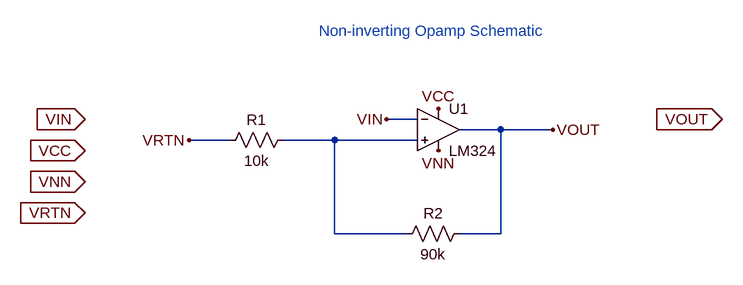
[diagram p0: schematic PreLab6_Alex_Villalba.asc]
PreLab6_Alex_Villalba.asc, the LTspice schematic file:
Version 4
SHEET 1 880 680
WIRE 320 96 272 96
WIRE 448 112 384 112
WIRE 528 112 448 112
WIRE 32 128 -32 128
WIRE 192 128 112 128
WIRE 320 128 192 128
WIRE 192 272 192 128
WIRE 304 272 192 272
WIRE 448 272 448 112
WIRE 448 272 384 272
FLAG -192 96 VIN
IOPIN -192 96 In
FLAG 688 96 VOUT
IOPIN 688 96 Out
FLAG -192 144 VCC
IOPIN -192 144 In
FLAG -192 192 VNN
IOPIN -192 192 In
FLAG -192 240 VRTN
IOPIN -192 240 In
FLAG -32 128 VRTN
FLAG 272 96 VIN
FLAG 352 80 VCC
FLAG 352 144 VNN
FLAG 528 112 VOUT
SYMBOL LM324 352 112 R0
SYMATTR InstName U1
SYMBOL res 128 112 R90
WINDOW 0 0 56 VBottom 2
WINDOW 3 32 56 VTop 2
SYMATTR InstName R1
SYMATTR Value 10k
SYMBOL res 400 256 R90
WINDOW 0 0 56 VBottom 2
WINDOW 3 32 56 VTop 2
SYMATTR InstName R2
SYMATTR Value 90k
TEXT 168 -40 Left 2 ;Non-inverting Opamp Schematic

The netlist it stands for:
* PreLab6_Alex_Villalba.asc
* U1: LM324 (symbol LM324 not available, pins judged from their places): In+=N001 In-=VIN V+=VCC V-=VNN OUT=VOUT
R1 N001 VRTN 10k
R2 VOUT N001 90k
* Non-inverting Opamp Schematic
.backanno
.end